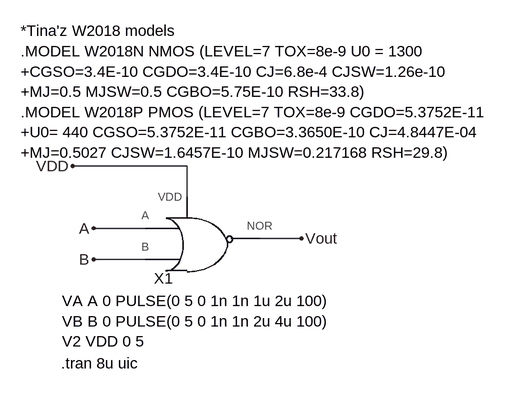
[diagram p0: schematic NORTest.asc]
NORTest.asc, the LTspice schematic file:
Version 4
SHEET 1 880 680
WIRE 240 224 64 224
WIRE 240 272 240 224
WIRE 176 320 96 320
WIRE 416 336 352 336
WIRE 176 368 96 368
FLAG 64 224 VDD
FLAG 96 320 A
FLAG 416 336 Vout
FLAG 96 368 B
SYMBOL NOR 240 320 R0
SYMATTR InstName X1
TEXT -16 16 Left 2 !*Tina'z W2018 models\n.MODEL W2018N NMOS (LEVEL=7 TOX=8e-9 U0 = 1300\n+CGSO=3.4E-10 CGDO=3.4E-10 CJ=6.8e-4 CJSW=1.26e-10\n+MJ=0.5 MJSW=0.5 CGBO=5.75E-10 RSH=33.8)\n.MODEL W2018P PMOS (LEVEL=7 TOX=8e-9 CGDO=5.3752E-11\n+U0= 440 CGSO=5.3752E-11 CGBO=3.3650E-10 CJ=4.8447E-04\n+MJ=0.5027 CJSW=1.6457E-10 MJSW=0.217168 RSH=29.8)
TEXT 48 432 Left 2 !VA A 0 PULSE(0 5 0 1n 1n 1u 2u 100)\nVB B 0 PULSE(0 5 0 1n 1n 2u 4u 100)\nV2 VDD 0 5
TEXT 46 528 Left 2 !.tran 8u uic

The netlist it stands for:
* NORTest.asc
XX1 A B VDD Vout NOR  ; pins A B VDD NOR
*Tina'z W2018 models
.MODEL W2018N NMOS (LEVEL=7 TOX=8e-9 U0 = 1300
+CGSO=3.4E-10 CGDO=3.4E-10 CJ=6.8e-4 CJSW=1.26e-10
+MJ=0.5 MJSW=0.5 CGBO=5.75E-10 RSH=33.8)
.MODEL W2018P PMOS (LEVEL=7 TOX=8e-9 CGDO=5.3752E-11
+U0= 440 CGSO=5.3752E-11 CGBO=3.3650E-10 CJ=4.8447E-04
+MJ=0.5027 CJSW=1.6457E-10 MJSW=0.217168 RSH=29.8)
VA A 0 PULSE(0 5 0 1n 1n 1u 2u 100)
VB B 0 PULSE(0 5 0 1n 1n 2u 4u 100)
V2 VDD 0 5
.tran 8u uic
.backanno
.end